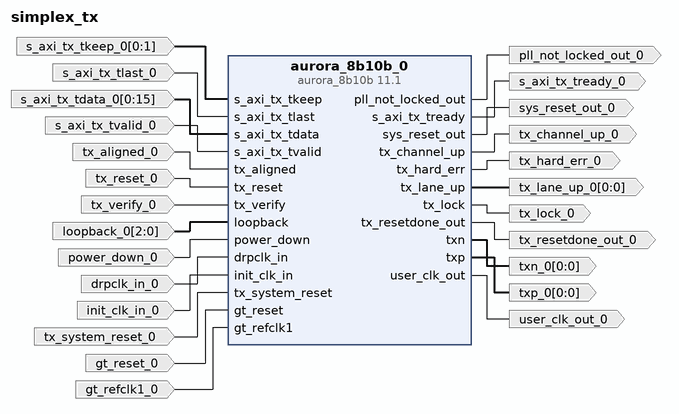
[diagram p0: block diagram of the top level]
# Vivado block design simplex_tx, xc7z045ffg900-2, Vivado 2018.3
create_bd_design simplex_tx

create_bd_port -dir I -from 0 -to 1 s_axi_tx_tkeep_0
create_bd_port -dir I s_axi_tx_tlast_0
create_bd_port -dir O s_axi_tx_tready_0
create_bd_port -dir I -from 0 -to 15 s_axi_tx_tdata_0
create_bd_port -dir I s_axi_tx_tvalid_0
create_bd_port -dir I tx_aligned_0
create_bd_port -dir I tx_reset_0
create_bd_port -dir I tx_verify_0
create_bd_port -dir I -from 2 -to 0 loopback_0
create_bd_port -dir I -type rst power_down_0
create_bd_port -dir I -type clk drpclk_in_0
create_bd_port -dir I -type clk init_clk_in_0
create_bd_port -dir I -type rst tx_system_reset_0
set_property -dict {CONFIG.POLARITY ACTIVE_HIGH} [get_bd_ports tx_system_reset_0]
create_bd_port -dir I -type rst gt_reset_0
set_property -dict {CONFIG.POLARITY ACTIVE_HIGH} [get_bd_ports gt_reset_0]
create_bd_port -dir I -type clk gt_refclk1_0
set_property -dict {CONFIG.FREQ_HZ 125000000} [get_bd_ports gt_refclk1_0]
create_bd_port -dir O tx_resetdone_out_0
create_bd_port -dir O tx_channel_up_0
create_bd_port -dir O tx_hard_err_0
create_bd_port -dir O -from 0 -to 0 tx_lane_up_0
create_bd_port -dir O tx_lock_0
create_bd_port -dir O pll_not_locked_out_0
create_bd_port -dir O -type clk user_clk_out_0
set_property -dict {CONFIG.FREQ_HZ 156250000} [get_bd_ports user_clk_out_0]
create_bd_port -dir O -type rst sys_reset_out_0
create_bd_port -dir O -from 0 -to 0 txn_0
create_bd_port -dir O -from 0 -to 0 txp_0

create_bd_cell -type ip -vlnv xilinx.com:ip:aurora_8b10b:11.1 aurora_8b10b_0
set_property -dict [list \
  CONFIG.C_DRP_IF false \
  CONFIG.Dataflow_Config TX-only_Simplex \
  CONFIG.SINGLEEND_GTREFCLK true \
  CONFIG.SINGLEEND_INITCLK true \
  CONFIG.SupportLevel 1 \
] [get_bd_cells aurora_8b10b_0]

# ---- connections ----

connect_bd_net -net s_axi_tx_tkeep_0_1 [get_bd_ports s_axi_tx_tkeep_0] [get_bd_pins aurora_8b10b_0/s_axi_tx_tkeep]
connect_bd_net -net s_axi_tx_tlast_0_1 [get_bd_ports s_axi_tx_tlast_0] [get_bd_pins aurora_8b10b_0/s_axi_tx_tlast]
connect_bd_net [get_bd_pins aurora_8b10b_0/s_axi_tx_tready] [get_bd_ports s_axi_tx_tready_0]
connect_bd_net -net s_axi_tx_tdata_0_1 [get_bd_ports s_axi_tx_tdata_0] [get_bd_pins aurora_8b10b_0/s_axi_tx_tdata]
connect_bd_net -net s_axi_tx_tvalid_0_1 [get_bd_ports s_axi_tx_tvalid_0] [get_bd_pins aurora_8b10b_0/s_axi_tx_tvalid]
connect_bd_net -net tx_aligned_0_1 [get_bd_ports tx_aligned_0] [get_bd_pins aurora_8b10b_0/tx_aligned]
connect_bd_net -net tx_reset_0_1 [get_bd_ports tx_reset_0] [get_bd_pins aurora_8b10b_0/tx_reset]
connect_bd_net -net tx_verify_0_1 [get_bd_ports tx_verify_0] [get_bd_pins aurora_8b10b_0/tx_verify]
connect_bd_net -net loopback_0_1 [get_bd_ports loopback_0] [get_bd_pins aurora_8b10b_0/loopback]
connect_bd_net -net power_down_0_1 [get_bd_ports power_down_0] [get_bd_pins aurora_8b10b_0/power_down]
connect_bd_net -net drpclk_in_0_1 [get_bd_ports drpclk_in_0] [get_bd_pins aurora_8b10b_0/drpclk_in]
connect_bd_net -net init_clk_in_0_1 [get_bd_ports init_clk_in_0] [get_bd_pins aurora_8b10b_0/init_clk_in]
connect_bd_net -net tx_system_reset_0_1 [get_bd_ports tx_system_reset_0] [get_bd_pins aurora_8b10b_0/tx_system_reset]
connect_bd_net -net gt_reset_0_1 [get_bd_ports gt_reset_0] [get_bd_pins aurora_8b10b_0/gt_reset]
connect_bd_net -net gt_refclk1_0_1 [get_bd_ports gt_refclk1_0] [get_bd_pins aurora_8b10b_0/gt_refclk1]
connect_bd_net [get_bd_pins aurora_8b10b_0/tx_resetdone_out] [get_bd_ports tx_resetdone_out_0]
connect_bd_net [get_bd_pins aurora_8b10b_0/tx_channel_up] [get_bd_ports tx_channel_up_0]
connect_bd_net [get_bd_pins aurora_8b10b_0/tx_hard_err] [get_bd_ports tx_hard_err_0]
connect_bd_net [get_bd_pins aurora_8b10b_0/tx_lane_up] [get_bd_ports tx_lane_up_0]
connect_bd_net [get_bd_pins aurora_8b10b_0/tx_lock] [get_bd_ports tx_lock_0]
connect_bd_net [get_bd_pins aurora_8b10b_0/pll_not_locked_out] [get_bd_ports pll_not_locked_out_0]
connect_bd_net [get_bd_pins aurora_8b10b_0/user_clk_out] [get_bd_ports user_clk_out_0]
connect_bd_net [get_bd_pins aurora_8b10b_0/sys_reset_out] [get_bd_ports sys_reset_out_0]
connect_bd_net [get_bd_pins aurora_8b10b_0/txn] [get_bd_ports txn_0]
connect_bd_net [get_bd_pins aurora_8b10b_0/txp] [get_bd_ports txp_0]

validate_bd_design
save_bd_design
